# Altium schematic sheet USB.SchDoc
size A4; SheetNumber: 7; SheetTotal: 15
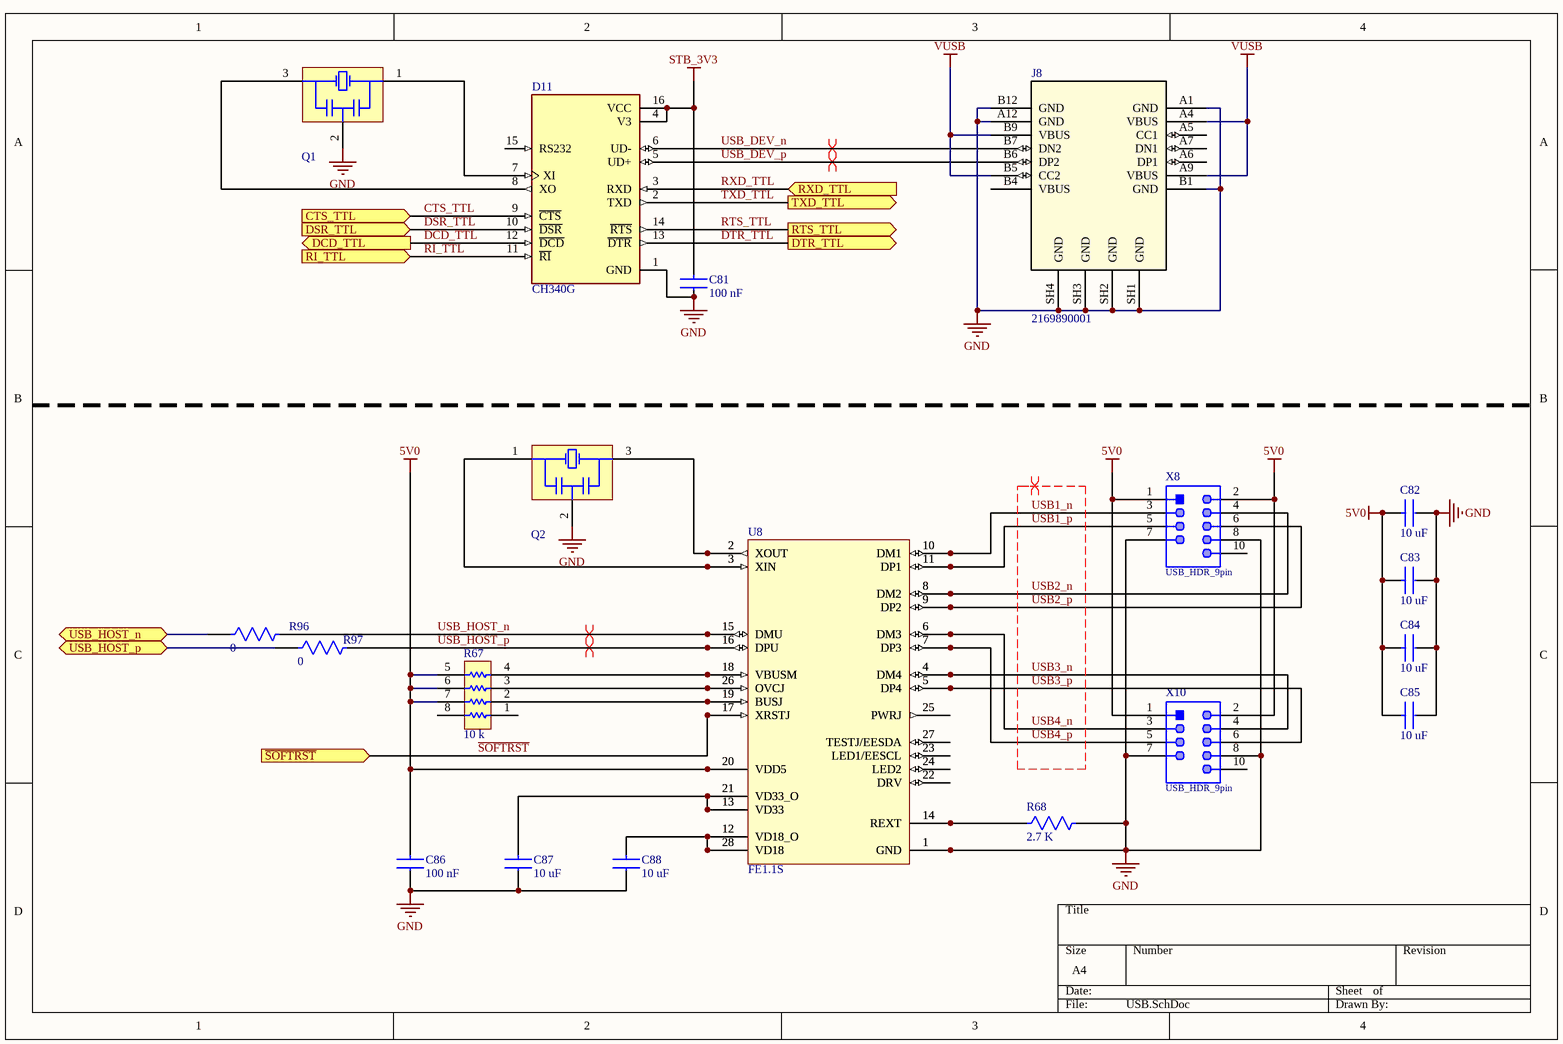
[diagram p0: USB.SchDoc]

## Parts
C81  Capacitance: 100 nF  [CC0805]  (hidden comment: CC0805-1.5pF)
C82  Capacitance: 10 uF  [CC0805]  (hidden comment: CC0805-1.5pF)
C83  Capacitance: 10 uF  [CC0805]  (hidden comment: CC0805-1.5pF)
C84  Capacitance: 10 uF  [CC0805]  (hidden comment: CC0805-1.5pF)
C85  Capacitance: 10 uF  [CC0805]  (hidden comment: CC0805-1.5pF)
C86  Capacitance: 100 nF  [CC0805]  (hidden comment: CC0805-1.5pF)
C87  Capacitance: 10 uF  [CC0805]  (hidden comment: CC0805-1.5pF)
C88  Capacitance: 10 uF  [CC0805]  (hidden comment: CC0805-1.5pF)
D11  CH340G  [SO16]
J8  2169890001  [216989-0001_MOL]
Q1  QTAL-12MHz  [MURA-CSTCE_G_V]  (value not drawn)
Q2  QTAL-12MHz  [MURA-CSTCE_G_V]  (value not drawn)
R67  Resistance: 10 k  [BOUR-CAY16-J4_V]  (hidden comment: CAY16-103J4LF)
R68  Resistance: 2.7 K  [CR0805]  (hidden comment: CR0805-51)
R96  Resistance: 0  [CR0805]  (hidden comment: CR0805-51)
R97  Resistance: 0  [CR0805]  (hidden comment: CR0805-51)
U8  FE1.1S  [TSOP64P600X160-28L]
X8  USB_HDR_9pin  [USB HDR 9 pin]
X10  USB_HDR_9pin  [USB HDR 9 pin]

## Ports
CTS_TTL (in), DCD_TTL (out), DSR_TTL (in), DTR_TTL (out), RI_TTL (in), RTS_TTL (out), RXD_TTL (in), TXD_TTL (out), USB_HOST_n (bidir), USB_HOST_p (bidir), ~{SOFTRST} (in)

## Nets
5V0: C82.1 C83.1 C84.1 C85.1 C86.1 R67.5 R67.6 R67.7 U8.20(VDD5) X8.1 X8.2 X10.1 X10.2
GND: C81.2 C82.2 C83.2 C84.2 C85.2 C86.2 C87.2 C88.2 D11.1(GND) J8.A1(GND) J8.A12(GND) J8.B1(GND) J8.B12(GND) J8.SH1(GND) J8.SH2(GND) J8.SH3(GND) J8.SH4(GND) Q1.2(GND) Q2.2(GND) R68.2 U8.1(GND) X8.7 X8.8 X10.7 X10.8
STB_3V3: C81.1 D11.4(V3) D11.16(VCC)
VUSB: J8.A4(VBUS) J8.A9(VBUS) J8.B5(CC2) J8.B9(VBUS)
CTS_TTL: D11.9(~{CTS}) ; port CTS_TTL
DCD_TTL: D11.12(~{DCD}) ; port DCD_TTL
DSR_TTL: D11.10(~{DSR}) ; port DSR_TTL
DTR_TTL: D11.13(~{DTR}) ; port DTR_TTL
RI_TTL: D11.11(~{RI}) ; port RI_TTL
RTS_TTL: D11.14(~{RTS}) ; port RTS_TTL
RXD_TTL: D11.3(RXD) ; port RXD_TTL
~{SOFTRST}: U8.17(XRSTJ) ; port ~{SOFTRST}
TXD_TTL: D11.2(TXD) ; port TXD_TTL
USB1_n: U8.10(DM1) X8.3
USB1_p: U8.11(DP1) X8.5
USB2_n: U8.8(DM2) X8.4
USB2_p: U8.9(DP2) X8.6
USB3_n: U8.4(DM4) X10.4
USB3_p: U8.5(DP4) X10.6
USB4_n: U8.6(DM3) X10.3
USB4_p: U8.7(DP3) X10.5
USB_DEV_n: D11.6(UD-) J8.B7(DN2)
USB_DEV_p: D11.5(UD+) J8.B6(DP2)
USB_HOST_n: R96.2 U8.15(DMU)
USB_HOST_n: R96.1 ; port USB_HOST_n  [a separate net that carries the same name]
USB_HOST_p: R97.2 U8.16(DPU)
USB_HOST_p: R97.1 ; port USB_HOST_p  [a separate net that carries the same name]
NetC87_1: C87.1 U8.13(VD33) U8.21(VD33_O)
NetC88_1: C88.1 U8.12(VD18_O) U8.28(VD18)
NetD11_7: D11.7(XI) Q1.1(X1)
NetD11_8: D11.8(XO) Q1.3(X2)
NetQ2_1: Q2.1(X1) U8.3(XIN)
NetQ2_3: Q2.3(X2) U8.2(XOUT)
NetR67_2: R67.2 U8.19(BUSJ)
NetR67_3: R67.3 U8.26(OVCJ)
NetR67_4: R67.4 U8.18(VBUSM)
NetR68_1: R68.1 U8.14(REXT)

Not connected (* = marked no-connect by the designer): D11 15(RS232); J8 A5(CC1) A6(DP1) A7(DN1) B4(VBUS); R67 1 8; U8 22(DRV) 23(LED1/EESCL) 24(LED2) 25(PWRJ) 27(TESTJ/EESDA); X8 10; X10 10

## Layout directives
differential pair: USB1_n, USB1_p, USB2_n, USB2_p, USB3_n, USB3_p, USB4_n, USB4_p, USB_DEV_n, USB_DEV_p, USB_HOST_n, USB_HOST_p

## Library data of the parts
C81-C88 = CC0805: CL21 Series 0805 1.5pF 50V ±0.25pF Tolerance C0G Multilayer Ceramic Chip Capacitor; Manufacturer Part Number: CL21C1R5CBANNNC; Manufacturer: Samsung; Category: Cap; value: 1.5pF; Case/Package: 0805
D11 = CH340G: USB Interface Integrated Circuit; Value: CH340G; Case/Package: SOIC-16; Category: IC
J8 = 2169890001: No Description Available; Mfr_Name: Molex Connector Corporation; Copyright: Copyright (C) 2022 Ultra Librarian. All rights reserved.; Manufacturer_Part_Number: 2169890001; RefDes: RefDes; Type: DEV
Q1 Q2 = QTAL-12MHz: Ceramic Resonator, 12 MHz, +/- 0.5%, -40 to 125 degC, 3-Pin SMD, RoHS, Tape and Reel; Manufacturer: Murata; Manufacturer Part Number: CSTCE12M0G55Z-R0; Capacitance: 33pF; value: CSTCE12M0G55Z-R0; Category: CrystalsandOscillators
R67 = CMP-1747-00005-1: Chip Resistor Array, 10 KOhm, +/- 5%, 62.5 mW, -55 to 125 degC, 8-Pin SMD, RoHS, Tape and Reel; Power Rating: 100 mW; Case\Package: 0603; Voltage Rating: 75 V; Tolerance: 1%; Packaging: Tape and Reel; Min Operating Temperature: -55 degC; Pins: 2; Radiation Hardening: No; DatasheetVersion: Jan-15; Length: 0.063 inch; RoHSCompliant: true; Mount: Surface Mount; ComponentLink1Description: Manufacturer URL; ComponentLink1URL: http://www.bourns.com/; Weight: 7.1E-05 oz; ComponentLink2URL: http://www.bourns.com/docs/Product-Datasheets/CATCAY.pdf; PackageReference: CAY16-J4; Width: 0.031 inch; Case Code (Imperial): 0603; Case Code (Metric): 1608; REACH SVHC: Yes; Max Operating Temperature: 155 degC; ComponentLink2Description: Datasheet; Height: 0.022 inch; PackageDescription: 8-Pin Surface Mount Device, Body 1.6 x 3.2 mm, Pitch 0.8 mm
R68 = CR0805: 51Ω ±0.5% 0.1W 1/10W Chip Resistor 0805 (2012 Metric) Thin Film; Manufacturer Part Number: RR1220Q-510-D; Manufacturer: Susumu; Category: Res; value: 51Ω; Case/Package: 0805; Number of Terminations: 2; Termination: SMD/SMT; Number of Pins: 2
R96 R97 = CR0805: 51Ω ±0.5% 0.1W 1/10W Chip Resistor 0805 (2012 Metric) Thin Film; Manufacturer: Susumu; Manufacturer Part Number: RR1220Q-510-D; Case/Package: 0805; Number of Pins: 2; Termination: SMD/SMT; value: 51Ω; Category: Res; Number of Terminations: 2
U8 = FE1.1S: USB 2.0 HIGH SPEED 4-PORT HUB CONTROLLER; Manufacturer: Terminus Technology Inc; value: FE1.1S; Case/Package: SSOP-28; Category: IC
X8 X10 = USB_HDR_9pin: THT Vertical Pin Header WR-PHD, Pitch 2.54 mm, Dual Row, 10 pins; Manufacturer: Wurth Elektronik; Part Number: 61301021121; Manufacturer: Wurth Electronics; Working Voltage: 250VAC; Pitch: 2.54mm; Contact Resistance: 20mOhm; Gender: Male; Rated Current: 3A; Withstanding Voltage: 500VAC; Pin Number: 10; Operating Temperature: -40to105degC; Mounting Technology: THT; Publisher: WurthElektronik; Manufacturer URL: http://www.we-online.de; Row Number: Dual; Packaging: Bag; Orientation: Vertical; Package Reference: 61301021121; Datasheet URL: https://katalog.we-online.de/em/datasheet/6130xx21121.pdf; Manufacturer Part Number: 61301021121